# EAGLE design 8xbc817 (EAGLE 6.5.0)
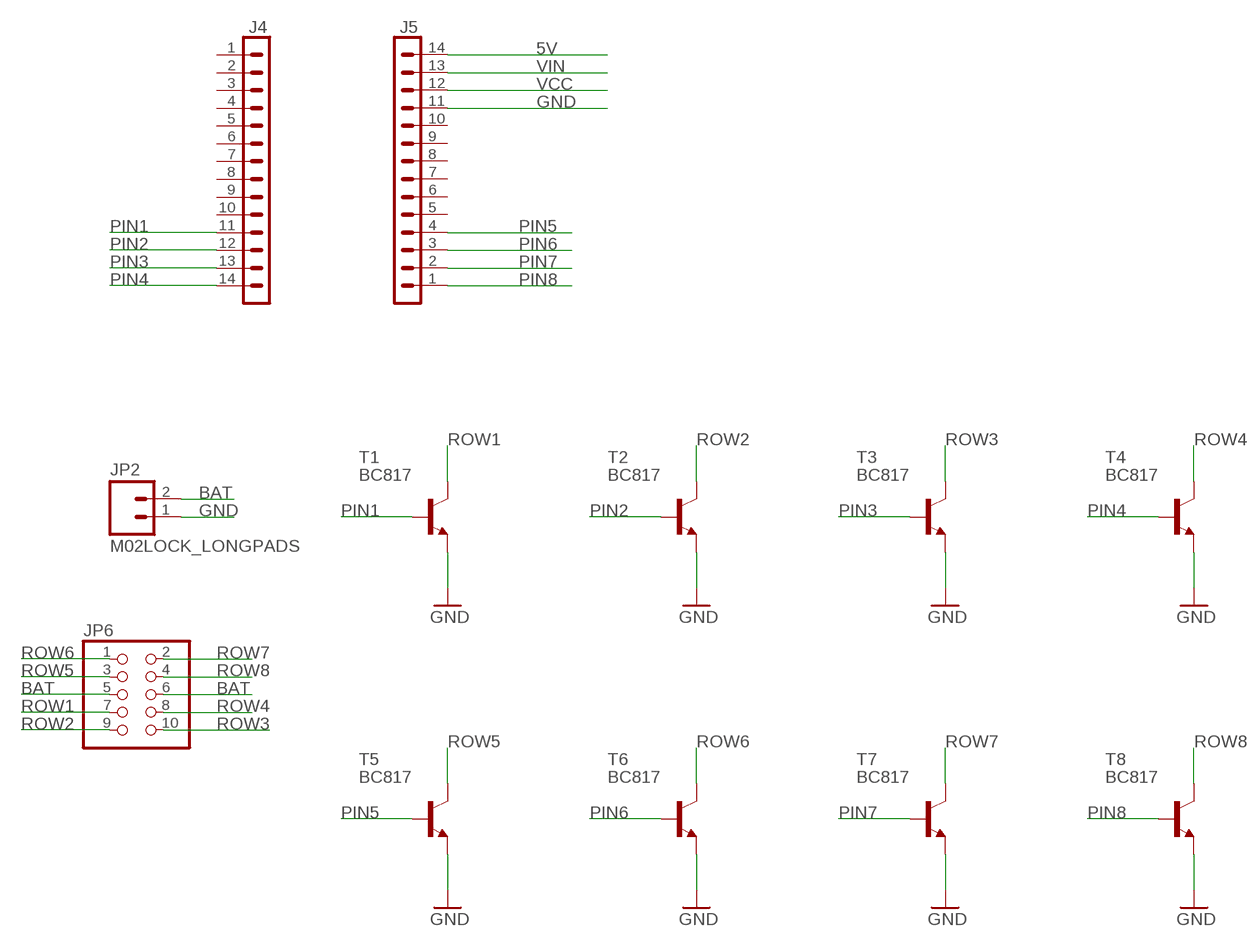
[diagram p0: schematic, sheet 1]

## Parts
J4  DNP  STRIP-14  [STRIP-14-MODULI-A11]
J5  DNP  STRIP-14  [STRIP-14-MODULI-A11]
JP2  M02LOCK_LONGPADS  [1X02_LOCK_LONGPADS]
JP6  PINHD-2X5  [2X05]
T1  BC817  BC847  [SOT23]
T2  BC817  BC847  [SOT23]
T3  BC817  BC847  [SOT23]
T4  BC817  BC847  [SOT23]
T5  BC817  BC847  [SOT23]
T6  BC817  BC847  [SOT23]
T7  BC817  BC847  [SOT23]
T8  BC817  BC847  [SOT23]

## Nets
5V: J5.14
BAT: JP2.2 JP6.5 JP6.6
GND: J5.11 JP2.1 T1.2(E) T2.2(E) T3.2(E) T4.2(E) T5.2(E) T6.2(E) T7.2(E) T8.2(E)
PIN1: J4.11 T1.1(B)
PIN2: J4.12 T2.1(B)
PIN3: J4.13 T3.1(B)
PIN4: J4.14 T4.1(B)
PIN5: J5.4 T5.1(B)
PIN6: J5.3 T6.1(B)
PIN7: J5.2 T7.1(B)
PIN8: J5.1 T8.1(B)
ROW1: JP6.7 T1.3(C)
ROW2: JP6.9 T2.3(C)
ROW3: JP6.10 T3.3(C)
ROW4: JP6.8 T4.3(C)
ROW5: JP6.3 T5.3(C)
ROW6: JP6.1 T6.3(C)
ROW7: JP6.2 T7.3(C)
ROW8: JP6.4 T8.3(C)
VCC: J5.12
VIN: J5.13
Unconnected: J4.1 J4.2 J4.3 J4.4 J4.5 J4.6 J4.7 J4.8 J4.9 J4.10 J5.5 J5.6 J5.7 J5.8 J5.9 J5.10

## Library data of the parts
J4 J5 = MK1_Zero:STRIP-14
JP2 = SparkFun-Connectors:M02: Standard 2-pin 0.1" header. Use with - straight break away headers ( PRT-00116) - right angle break away headers (PRT-00553) - swiss pins (PRT-00743) - machine pins (PRT-00117) - female headers (PRT-00115) Molex polarized connector foot print use with: PRT-08233 with associated crimp pins and housings. 2.54_SCREWTERM for use with PRT-10571. 3.5mm Screw Terminal footprints for PRT-08084 5mm Screw Terminal footprints for use with PRT-08433
JP6 = pinhead:PINHD-2X5: PIN HEADER
T1-T8 = transistor:BC847: NPN TRANSISTOR

## Board
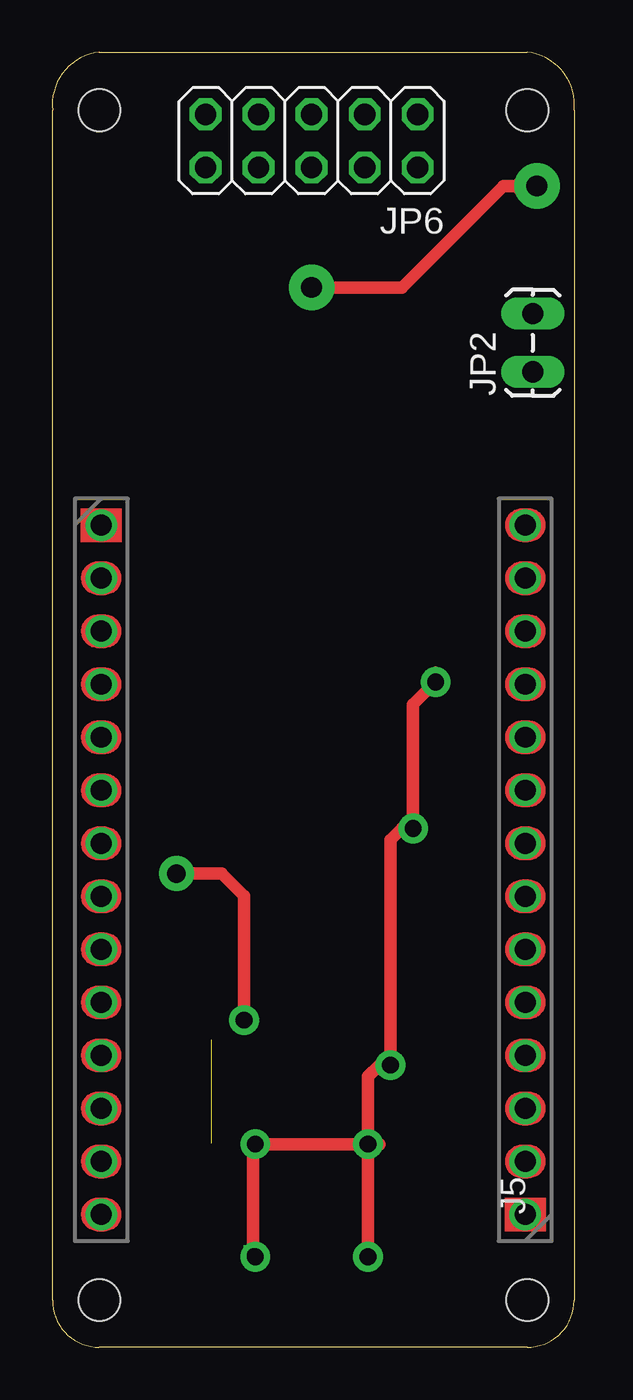
[diagram p1: board, top side]
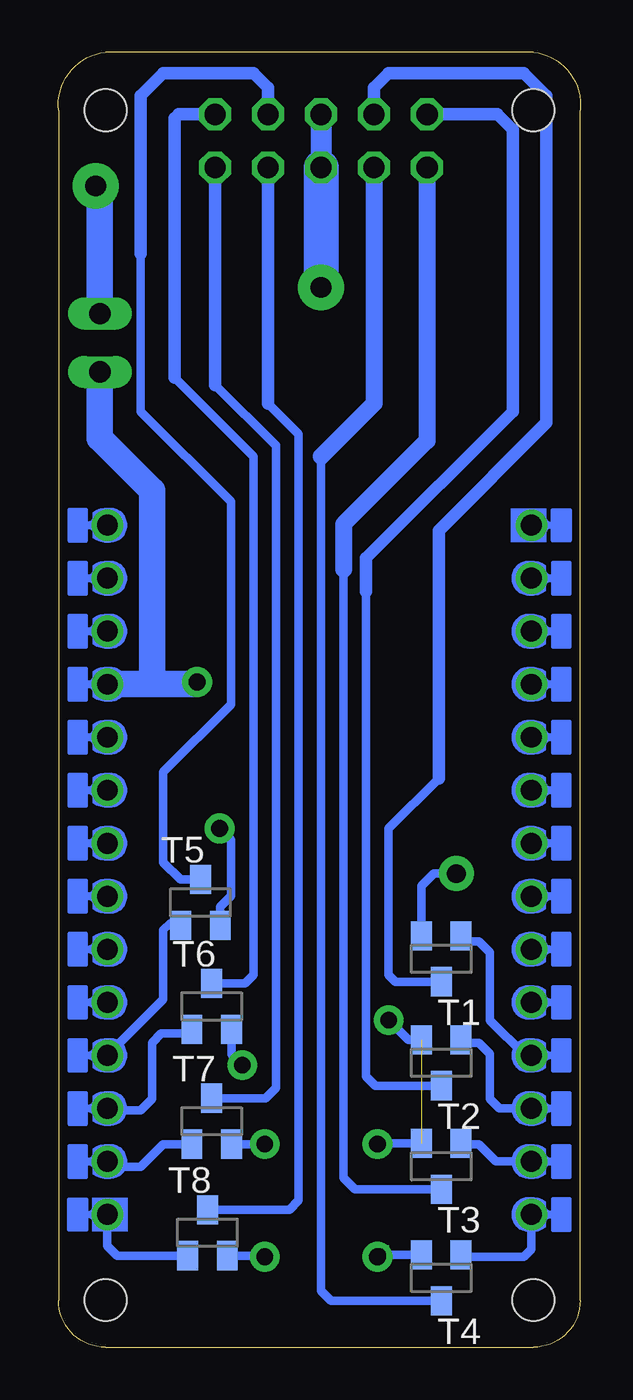
[diagram p2: board, bottom side, seen from below]

Size 25.03 x 62.04 mm. Coordinates in mm from the lower left corner, seen from the top.
Outline: 0.01,2.25 0.01,59.25 arc-90 2.26,62.04 22.76,62.04 arc-90 25.01,59.25 25.01,2.25 arc-90 22.76,0 2.26,0 arc-90 0.01,2.25
Copper layers (1*16): Top 0.035mm / dielectric 1.5mm / Bottom 0.035mm
Design rules "SeeedStudio_2layers *": minimum track width 6mil, minimum drill 12mil, track to track 6mil, track to pad 6mil, pad to pad 6mil, via to via 6mil, smd to smd 0mil, copper to edge 10mil, drill to drill 10mil, minimum pad ring 10mil, minimum via ring 6mil, stop-mask expansion 2mil, vias tented up to drill 100mil, thermal gap 10mil
Holes 2 mm at 2.26,59.26 22.76,59.26 22.76,2.26 2.26,2.26

### Footprints (pad centres in the part's own frame; a part is rotated, then mirrored left to right if it is on the bottom)
STRIP-14-MODULI-A11 = drill 1: 1 0,0; 2 2.54,0; 3 5.08,0; 4 7.62,0; 5 10.16,0; 6 12.7,0; 7 15.24,0; 8 17.78,0; 9 20.32,0; 10 22.86,0; 11 25.4,0; 12 27.94,0; 13 30.48,0; 14 33.02,0
1X02_LOCK_LONGPADS = drill 1.016 long: 1 -0.127,0; 2 2.667,0
2X05 = drill 1.016 octagon: 1 -5.08,-1.27; 2 -5.08,1.27; 3 -2.54,-1.27; 4 -2.54,1.27; 5 0,-1.27; 6 0,1.27; 7 2.54,-1.27; 8 2.54,1.27; 9 5.08,-1.27; 10 5.08,1.27
SOT23 = smd 1 x 1.4: 1 -0.95,-1.1; 2 0.95,-1.1; 3 0,1.1

### Placement (x,y rotation side)
J4  2.35,39.38 270 top
J5  22.67,6.36 90 top
JP2  23.03,46.85 90 top
JP6  12.43,57.79 180 top
T1  6.67,18.61 180 bottom
T2  6.67,13.63 180 bottom
T3  6.67,8.67 180 bottom
T4  6.67,3.33 180 bottom
T5  18.21,21.31 0 bottom
T6  17.67,16.33 0 bottom
T7  17.67,10.83 0 bottom
T8  17.87,5.49 0 bottom

### Tracks (layer width: path | path; a pad name or v marks a point on that pad's centre or on a via)
BAT  (via drill 1 pad 2.18)
  Top 0.61: 22.69,55.63 21.61,55.63 16.75,50.77 v12.43,50.77
  Top 1.27: v23.23,55.63 22.69,55.63
  Bottom 1.016: JP6.5 JP6.6
  Bottom 1.27: 12.75,51.09 v12.43,50.77 | JP2.2 23.03,55.29 v23.23,55.63
  Bottom 1.676: JP6.6 v12.43,50.77
GND  (via drill 0.6, 0.8 pad 1.42, 0.9 pad 1.68)  (1 unrouted)
  Top 0.406: v18.37,31.87 18.37,32.41
  Top 0.61: v9.19,15.67 9.19,21.61 8.11,22.69 v5.95,22.69 | v9.63,4.43 9.63,9.63 v9.73,9.73 v15.13,9.73 | v15.13,9.73 15.67,9.73 | v15.13,9.73 v15.13,4.33 | v15.13,9.73 15.13,12.97 15.67,13.51 v16.21,13.51 16.21,24.31 16.75,24.85 v17.29,24.85 17.29,30.79 v18.37,31.87
  Bottom 0.406: T1.2 7.62,22.1 7.03,22.69 v5.95,22.69 | T2.2 8.25,14.73 v9.19,15.67 | T3.2 9.69,9.77 v9.73,9.73 | T4.2 v9.63,4.43 v9.73,4.33 | T8.2 15.19,4.39 v15.13,4.33 | T7.2 v15.13,9.73 | T6.2 16.72,14.02 v16.21,13.51 | T5.2 17.26,21.1 16.75,21.61 16.75,24.31 v17.29,24.85
  Bottom 1.27: JP2.1 23.03,43.55 20.53,41.05 20.53,31.76 | J5.11 20.53,31.76 | 20.53,31.76 18.48,31.76 v18.37,31.87
PIN1
  Bottom 0.406: J4.11 2.65,13.98 4.33,15.67 4.33,18.91 4.87,19.45 5.62,19.45 5.79,19.62 | 5.79,19.62 5.9,19.73 | T1.1 5.72,19.68 5.79,19.62
PIN2
  Bottom 0.406: J4.12 3.89,11.44 4.33,11.89 4.33,14.05 4.87,14.59 5.76,14.59 | 5.76,14.59 5.9,14.45 | 5.76,14.59 5.76,14.69 T2.1
PIN3
  Bottom 0.406: J4.13 4.05,8.9 4.87,9.73 5.86,9.73 | 5.86,9.73 5.9,9.69 | T3.1 5.82,9.77 5.86,9.73
PIN4
  Bottom 0.406: J4.14 2.35,4.69 2.71,4.33 5.8,4.33 | 5.8,4.33 5.9,4.23 | T4.1 5.72,4.41 5.8,4.33
PIN5
  Bottom 0.406: J5.4 19.99,16.66 19.99,19.99 19.67,20.31 18.94,20.31 19.04,20.21 T5.1
PIN6
  Bottom 0.406: J5.3 22.58,11.35 21.07,11.35 20.53,11.89 20.53,14.59 20.09,15.03 18.94,15.03 18.74,15.23 T6.1
PIN7
  Bottom 0.406: T7.1 19.99,9.73 21.07,8.65 22.42,8.65 J5.2
PIN8
  Bottom 0.406: T8.1 22.21,4.39 22.69,4.87 22.69,6.34 J5.1
ROW1
  Bottom 0.406: T1.3 8.87,17.51 9.19,17.83 9.19,24.85 6.79,27.25
  Bottom 0.61: 6.79,27.25 6.79,39.13 1.63,44.29 1.63,59.95 2.71,61.03 9.19,61.03 9.89,60.33 JP6.7
ROW2
  Bottom 0.406: T2.3 9.83,12.53 10.27,12.97 10.27,36.19
  Bottom 0.61: JP6.9 3.98,59.06 3.25,58.33 3.25,44.83 10.27,37.81 10.27,36.19
ROW3
  Bottom 0.406: T3.3 10.81,7.57 11.35,8.11 11.35,37.27
  Bottom 0.813: JP6.10 7.35,43.43 11.35,39.43 11.35,37.27
ROW4
  Bottom 0.406: T4.3 11.95,2.23 12.43,2.71 12.43,42.67
  Bottom 0.813: JP6.8 9.89,45.21 12.43,42.67
ROW5
  Bottom 0.406: T5.3 19.17,22.41 19.99,23.23 19.99,27.55 16.75,30.79 16.75,40.51 21.07,44.83 21.07,52.39
  Bottom 0.61: JP6.3 14.97,60.33 15.67,61.03 19.99,61.03 21.07,59.95 21.07,52.39
ROW6
  Bottom 0.406: T6.3 16.07,17.43 15.67,17.83 15.67,42.67 19.45,46.45
  Bottom 0.61: JP6.1 19.26,59.06 19.45,58.87 19.45,46.45
ROW7
  Bottom 0.406: T7.3 15.09,11.93 14.59,12.43 14.59,43.21 14.62,43.21 17.51,46.1
  Bottom 0.61: JP6.2 17.51,46.1
ROW8
  Bottom 0.406: T8.3 13.95,6.59 13.51,7.03 13.51,43.75 13.7,43.94 14.97,45.21
  Bottom 0.61: JP6.4 14.97,45.21